# EAGLE design TinyNES_RGB_DIN_Cable (EAGLE 9.6.2)
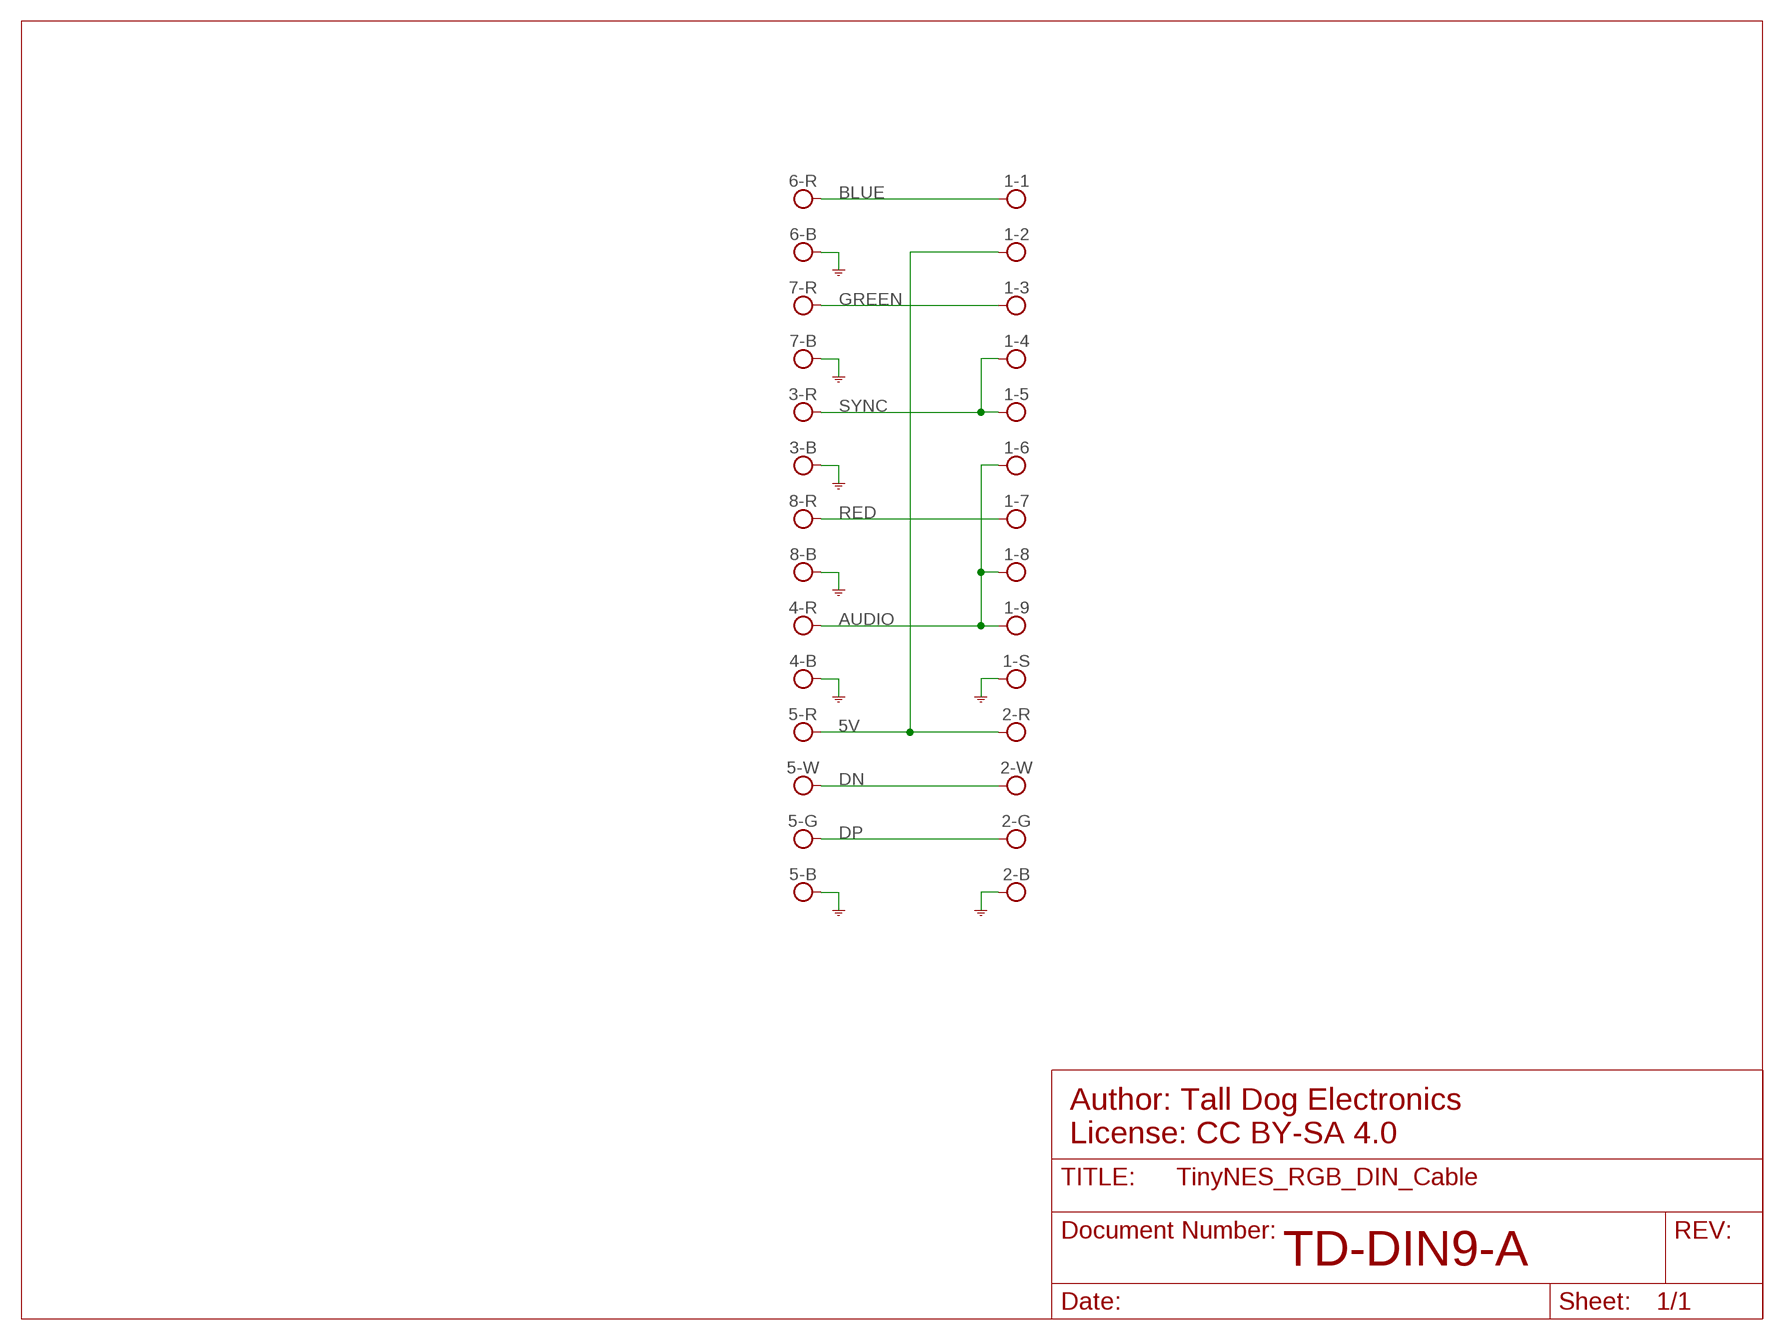
[diagram p0: schematic, sheet 1]

## Parts
1-1  HOLE-CABLE-PAD  [CABLE-PAD]
1-2  HOLE-CABLE-PAD  [CABLE-PAD]
1-3  HOLE-CABLE-PAD  [CABLE-PAD]
1-4  HOLE-CABLE-PAD  [CABLE-PAD]
1-5  HOLE-CABLE-PAD  [CABLE-PAD]
1-6  HOLE-CABLE-PAD  [CABLE-PAD]
1-7  HOLE-CABLE-PAD  [CABLE-PAD]
1-8  HOLE-CABLE-PAD  [CABLE-PAD]
1-9  HOLE-CABLE-PAD  [CABLE-PAD]
1-S  HOLE-CABLE-PAD  [CABLE-PAD]
2-B  HOLE-CABLE-PAD  [CABLE-PAD]
2-G  HOLE-CABLE-PAD  [CABLE-PAD]
2-R  HOLE-CABLE-PAD  [CABLE-PAD]
2-W  HOLE-CABLE-PAD  [CABLE-PAD]
3-B  HOLE-CABLE-PAD  [CABLE-PAD]
3-R  HOLE-CABLE-PAD  [CABLE-PAD]
4-B  HOLE-CABLE-PAD  [CABLE-PAD]
4-R  HOLE-CABLE-PAD  [CABLE-PAD]
5-B  HOLE-CABLE-PAD  [CABLE-PAD]
5-G  HOLE-CABLE-PAD  [CABLE-PAD]
5-R  HOLE-CABLE-PAD  [CABLE-PAD]
5-W  HOLE-CABLE-PAD  [CABLE-PAD]
6-B  HOLE-CABLE-PAD  [CABLE-PAD]
6-R  HOLE-CABLE-PAD  [CABLE-PAD]
7-B  HOLE-CABLE-PAD  [CABLE-PAD]
7-R  HOLE-CABLE-PAD  [CABLE-PAD]
8-B  HOLE-CABLE-PAD  [CABLE-PAD]
8-R  HOLE-CABLE-PAD  [CABLE-PAD]

## Nets
5V: 1-2.P 2-R.P 5-R.P
AUDIO: 1-6.P 1-8.P 1-9.P 4-R.P
BLUE: 1-1.P 6-R.P
DN: 2-W.P 5-W.P
DP: 2-G.P 5-G.P
GND: 1-S.P 2-B.P 3-B.P 4-B.P 5-B.P 6-B.P 7-B.P 8-B.P
GREEN: 1-3.P 7-R.P
RED: 1-7.P 8-R.P
SYNC: 1-4.P 1-5.P 3-R.P

## Notes on the sheet
- Author: Tall Dog Electronics
  License: CC BY-SA 4.0
- TD-DIN9-A

## Library data of the parts
1-1-1-9 1-S 2-B 2-G 2-R 2-W 3-B 3-R 4-B 4-R 5-B 5-G 5-R 5-W 6-B 6-R 7-B 7-R 8-B 8-R = TinyNES_Library:HOLE

## Board
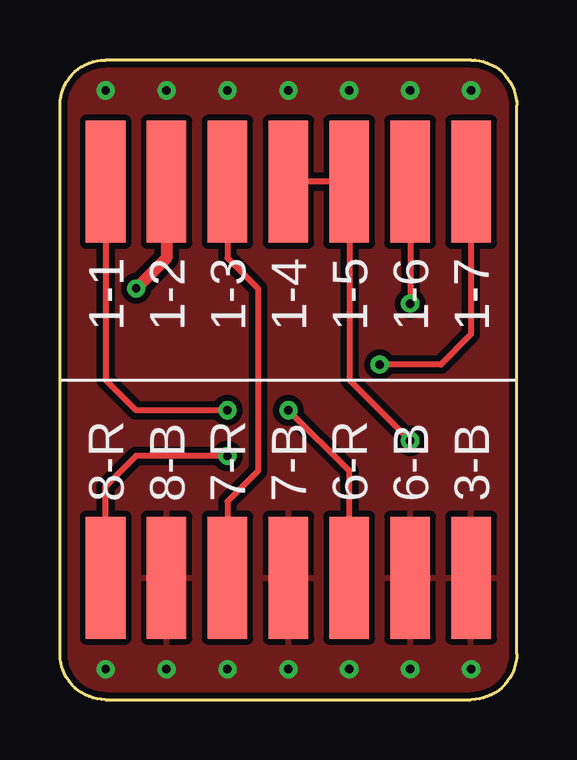
[diagram p1: board, top side]
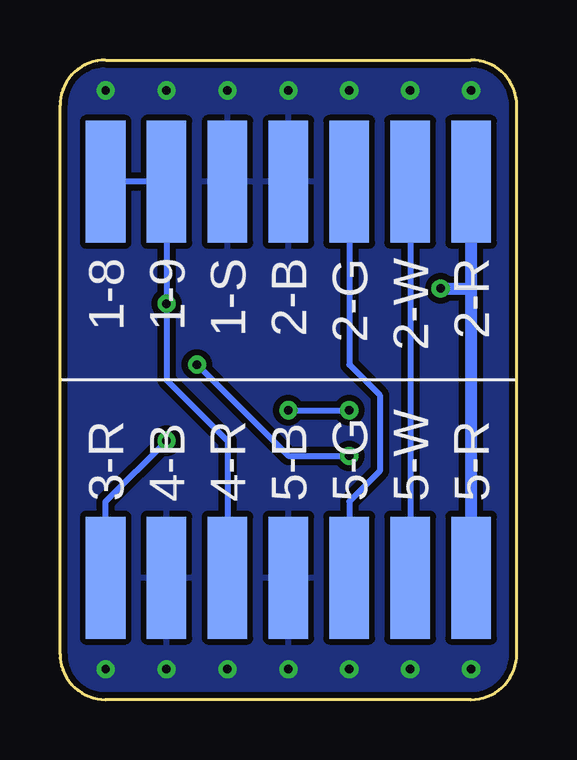
[diagram p2: board, bottom side, seen from below]

Size 19.05 x 26.67 mm. Coordinates in mm from the lower left corner, seen from the top.
Outline: 1.91,0 17.14,0 arc90 19.05,1.91 19.05,24.77 arc90 17.14,26.67 1.91,26.67 arc90 0,24.77 0,1.91 arc90 1.91,0
Copper layers (1*16): Top 0.035mm / dielectric 1.5mm / Bottom 0.035mm
Design rules "default *": minimum track width 10mil, minimum drill 12mil, track to track 8mil, track to pad 8mil, pad to pad 8mil, via to via 8mil, smd to smd 8mil, copper to edge 8mil, drill to drill 8mil, minimum pad ring 8mil, minimum via ring 8mil, stop-mask expansion 0mil, vias tented up to drill 0.35mm, thermal gap 10mil

### Footprints (pad centres in the part's own frame; a part is rotated, then mirrored left to right if it is on the bottom)
CABLE-PAD = smd 5.08 x 1.651: P 0,0

### Placement (x,y rotation side)
1-1  1.91,21.59 270 top
1-2  4.45,21.59 270 top
1-3  6.99,21.59 270 top
1-4  9.53,21.59 270 top
1-5  12.06,21.59 270 top
1-6  14.61,21.59 270 top
1-7  17.14,21.59 270 top
1-8  17.14,21.59 270 bottom
1-9  14.61,21.59 270 bottom
1-S  12.06,21.59 270 bottom
2-B  9.53,21.59 270 bottom
2-G  6.99,21.59 270 bottom
2-R  1.91,21.59 270 bottom
2-W  4.45,21.59 270 bottom
3-B  17.14,5.08 90 top
3-R  17.14,5.08 90 bottom
4-B  14.61,5.08 90 bottom
4-R  12.06,5.08 90 bottom
5-B  9.53,5.08 90 bottom
5-G  6.99,5.08 90 bottom
5-R  1.91,5.08 90 bottom
5-W  4.45,5.08 90 bottom
6-B  14.61,5.08 90 top
6-R  12.06,5.08 90 top
7-B  9.53,5.08 90 top
7-R  6.99,5.08 90 top
8-B  4.45,5.08 90 top
8-R  1.91,5.08 90 top

### Tracks (layer width: path | path; a pad name or v marks a point on that pad's centre or on a via)
5V  (via drill 0.35)
  Top 0.508: 1-2.P 4.45,18.41 v3.17,17.14
  Bottom 0.508: 2-R.P 1.91,17.14 | 1.91,17.14 5-R.P | v3.17,17.14 1.91,17.14
AUDIO  (via drill 0.35)
  Top 0.254: 1-6.P v14.61,16.51
  Bottom 0.254: 1-8.P 1-6.P v14.61,16.51 14.61,13.34 12.06,10.79 4-R.P
BLUE  (via drill 0.35)
  Top 0.254: 6-R.P 12.06,9.53 v9.53,12.06 | 1-1.P 1.91,13.34 3.17,12.06 v6.99,12.06
  Bottom 0.254: v9.53,12.06 v6.99,12.06
DN
  Bottom 0.254: 2-W.P 5-W.P
DP
  Bottom 0.254: 2-G.P 6.99,13.97 5.71,12.7 5.71,9.53 6.99,8.26 5-G.P
GND  (via drill 0.35)
  other vias: 9.53,1.27 1.91,1.27 14.61,1.27 14.61,25.4 9.53,25.4 4.45,25.4 4.45,1.27 6.99,1.27 12.06,1.27 17.14,1.27 1.91,25.4 6.99,25.4 12.06,25.4 17.14,25.4
  pour Bottom (isolate 0.254): 0,26.67 19.05,26.67 19.05,0 0,0
  pour Top (isolate 0.254): 0,26.67 19.05,26.67 19.05,0 0,0
GREEN
  Top 0.254: 1-3.P 6.99,18.41 8.26,17.14 8.26,9.53 6.99,8.26 7-R.P
RED  (via drill 0.35)
  Top 0.254: 8-R.P 1.91,8.89 3.17,10.16 v6.99,10.16 | v13.34,13.97 15.88,13.97 17.14,15.24 1-7.P
  Bottom 0.254: v13.34,13.97 9.53,10.16 v6.99,10.16
SYNC  (via drill 0.35)
  Top 0.254: 1-4.P 1-5.P 12.06,13.34 v14.61,10.79
  Bottom 0.254: 3-R.P 17.14,8.26 v14.61,10.79

### Text on the board
bDocu: H3